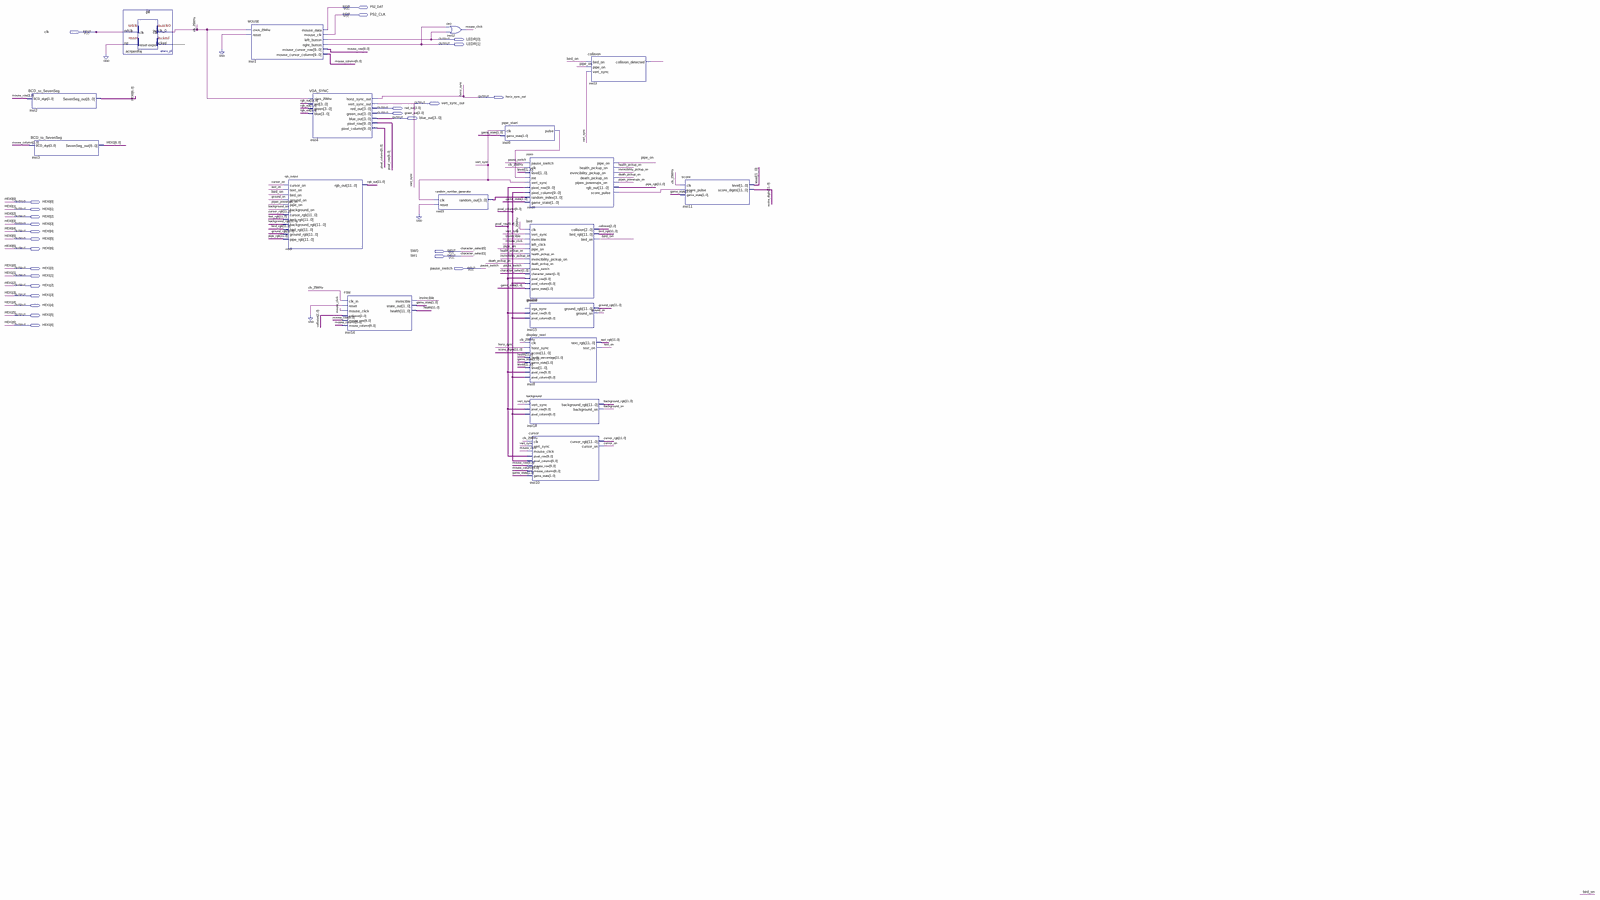
[diagram p0: schematic sheet, whole]
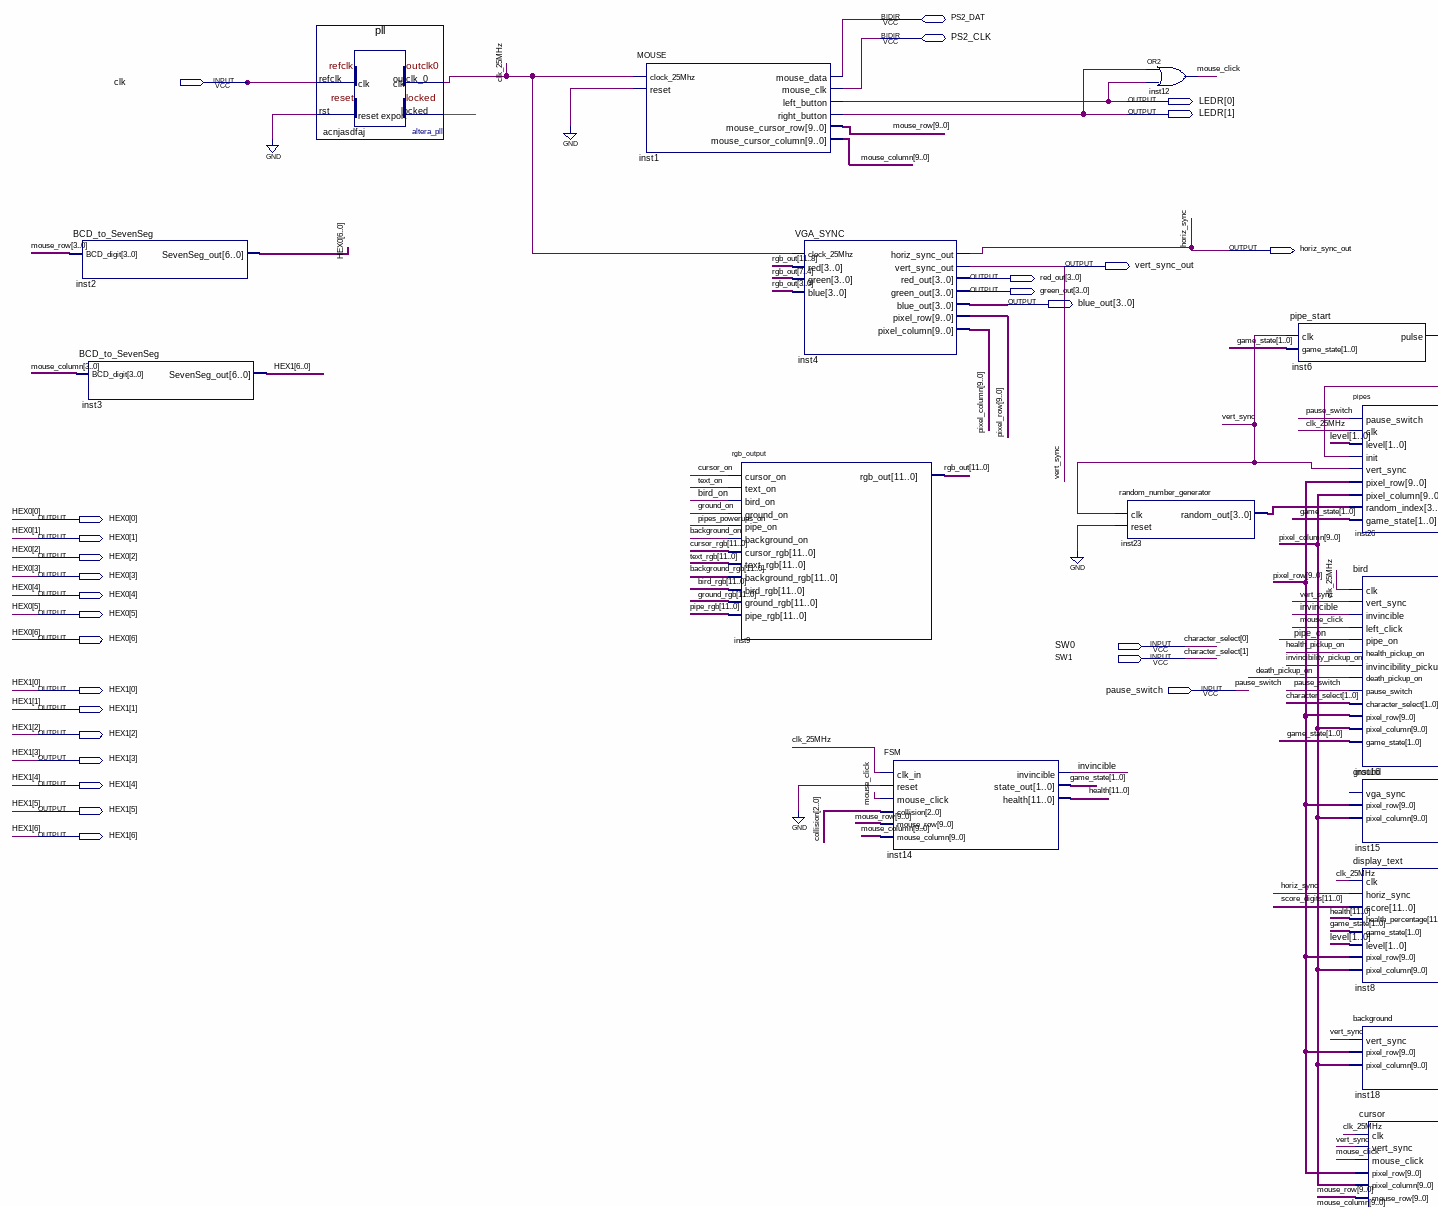
[diagram p1: schematic sheet, upper left part]
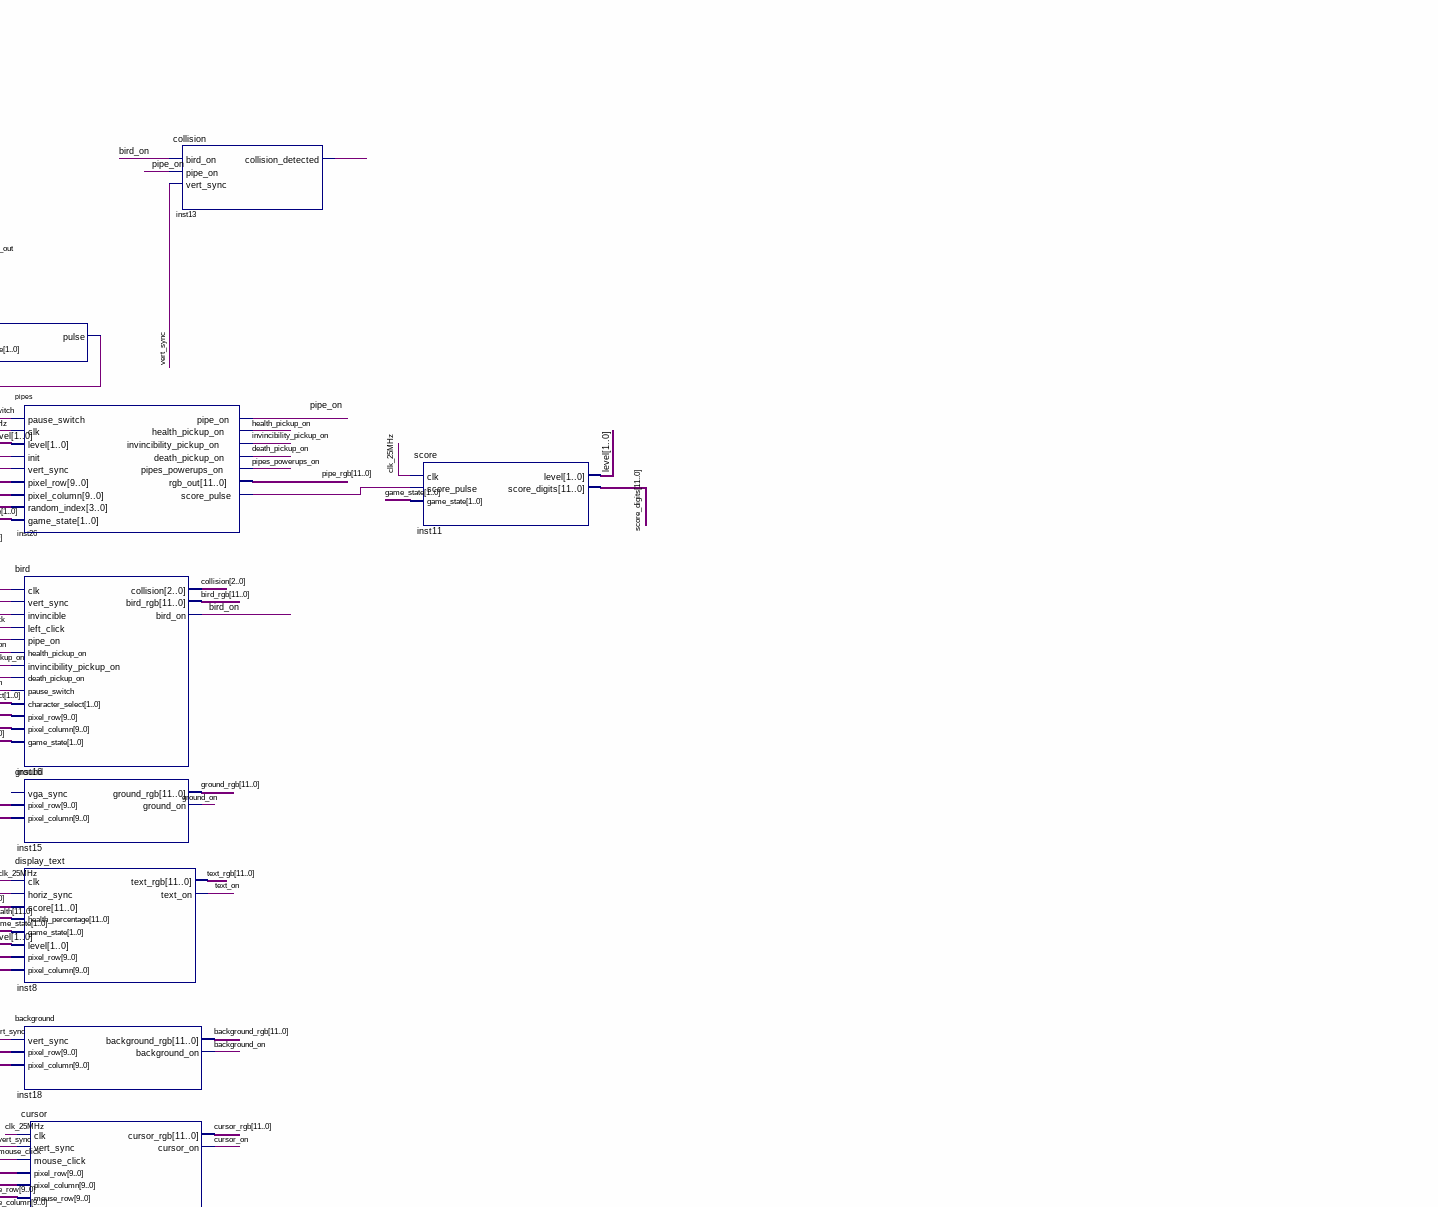
[diagram p2: schematic sheet, upper centre part]
// Quartus schematic Flappy-Bird.bdf as structural Verilog: 18 symbols, 27 pins
module \Flappy-Bird  (
  input  clk,
  input  SW0,
  input  SW1,
  input  pause_switch,
  inout  PS2_DAT,
  inout  PS2_CLK,
  output [1:0] LEDR,
  output horiz_sync_out,
  output vert_sync_out,
  output [3:0] red_out,
  output [3:0] green_out,
  output [3:0] blue_out,
  output [6:0] HEX0,
  output [6:0] HEX1
);

  wire background_on, bird_on, clk_25MHz, cursor_on, death_pickup_on, ground_on, health_pickup_on,
       inst6_pulse, inst13_collision_detected, inst26_score_pulse, invincibility_pickup_on, invincible,
       mouse_click, pipe_on, pipes_powerups_on, text_on;
  wire [1:0] game_state, level;
  wire [2:0] collision;
  wire [3:0] inst23_random_out;
  wire [9:0] mouse_column, mouse_row, pixel_column, pixel_row;
  wire [11:0] background_rgb, bird_rgb, cursor_rgb, ground_rgb, health, pipe_rgb, rgb_out, score_digits,
       text_rgb;

  BCD_to_SevenSeg inst2 (.BCD_digit(mouse_row[3:0]), .SevenSeg_out(HEX0));
  BCD_to_SevenSeg inst3 (.BCD_digit(mouse_column[3:0]), .SevenSeg_out(HEX1));
  pll acnjasdfaj (.refclk(clk), .rst(1'b0), .outclk_0(clk_25MHz));  // open: locked
  MOUSE inst1 (
    .clock_25Mhz(clk_25MHz), .reset(1'b0), .left_button(LEDR[0]), .right_button(LEDR[1]),
    .mouse_cursor_row(mouse_row), .mouse_cursor_column(mouse_column), .mouse_data(PS2_DAT),
    .mouse_clk(PS2_CLK));
  rgb_output inst9 (
    .cursor_on(cursor_on), .text_on(text_on), .bird_on(bird_on), .ground_on(ground_on),
    .pipe_on(pipes_powerups_on), .background_on(background_on), .cursor_rgb(cursor_rgb), .text_rgb(text_rgb),
    .background_rgb(background_rgb), .bird_rgb(bird_rgb), .ground_rgb(ground_rgb), .pipe_rgb(pipe_rgb),
    .rgb_out(rgb_out));
  VGA_SYNC inst4 (
    .clock_25Mhz(clk_25MHz), .red(rgb_out[11:8]), .green(rgb_out[7:4]), .blue(rgb_out[3:0]),
    .horiz_sync_out(horiz_sync_out), .vert_sync_out(vert_sync_out), .red_out(red_out), .green_out(green_out),
    .blue_out(blue_out), .pixel_row(pixel_row), .pixel_column(pixel_column));
  FSM inst14 (
    .clk_in(clk_25MHz), .reset(1'b0), .mouse_click(mouse_click), .collision(collision),
    .mouse_row(mouse_row), .mouse_column(mouse_column), .invincible(invincible), .state_out(game_state),
    .health(health));
  random_number_generator inst23 (.clk(vert_sync_out), .reset(1'b0), .random_out(inst23_random_out));
  or inst12 (mouse_click, LEDR[1], LEDR[0]);
  pipe_start inst6 (.clk(vert_sync_out), .game_state(game_state), .pulse(inst6_pulse));
  pipes inst26 (
    .pause_switch(pause_switch), .clk(clk_25MHz), .level(level), .init(inst6_pulse),
    .vert_sync(vert_sync_out), .pixel_row(pixel_row), .pixel_column(pixel_column),
    .random_index(inst23_random_out), .game_state(game_state), .pipe_on(pipe_on),
    .health_pickup_on(health_pickup_on), .invincibility_pickup_on(invincibility_pickup_on),
    .death_pickup_on(death_pickup_on), .pipes_powerups_on(pipes_powerups_on), .rgb_out(pipe_rgb),
    .score_pulse(inst26_score_pulse));
  bird inst16 (
    .clk(clk_25MHz), .vert_sync(vert_sync_out), .invincible(invincible), .left_click(mouse_click),
    .pipe_on(pipe_on), .health_pickup_on(health_pickup_on),
    .invincibility_pickup_on(invincibility_pickup_on), .death_pickup_on(death_pickup_on),
    .pause_switch(pause_switch), .character_select({SW1, SW0}), .pixel_row(pixel_row),
    .pixel_column(pixel_column), .game_state(game_state), .collision(collision), .bird_rgb(bird_rgb),
    .bird_on(bird_on));
  ground inst15 (
    .pixel_row(pixel_row), .pixel_column(pixel_column), .ground_rgb(ground_rgb), .ground_on(ground_on));  // open: vga_sync
  display_text inst8 (
    .clk(clk_25MHz), .horiz_sync(horiz_sync_out), .score(score_digits), .health_percentage(health),
    .game_state(game_state), .level(level), .pixel_row(pixel_row), .pixel_column(pixel_column),
    .text_rgb(text_rgb), .text_on(text_on));
  background inst18 (
    .vert_sync(vert_sync_out), .pixel_row(pixel_row), .pixel_column(pixel_column),
    .background_rgb(background_rgb), .background_on(background_on));
  cursor inst10 (
    .clk(clk_25MHz), .vert_sync(vert_sync_out), .mouse_click(mouse_click), .pixel_row(pixel_row),
    .pixel_column(pixel_column), .mouse_row(mouse_row), .mouse_column(mouse_column), .game_state(game_state),
    .cursor_rgb(cursor_rgb), .cursor_on(cursor_on));
  collision inst13 (
    .bird_on(bird_on), .pipe_on(pipe_on), .vert_sync(vert_sync_out),
    .collision_detected(inst13_collision_detected));
  score inst11 (
    .clk(clk_25MHz), .score_pulse(inst26_score_pulse), .game_state(game_state), .level(level),
    .score_digits(score_digits));

  // Other names for the same wires on the sheet: character_select[1:0] = {SW1, SW0}; horiz_sync = horiz_sync_out;
  //   vert_sync = vert_sync_out
endmodule
